# Altium schematic sheet SPC56_ControllerBoard_1.0.0.SchDoc
size 381 x 508 mm
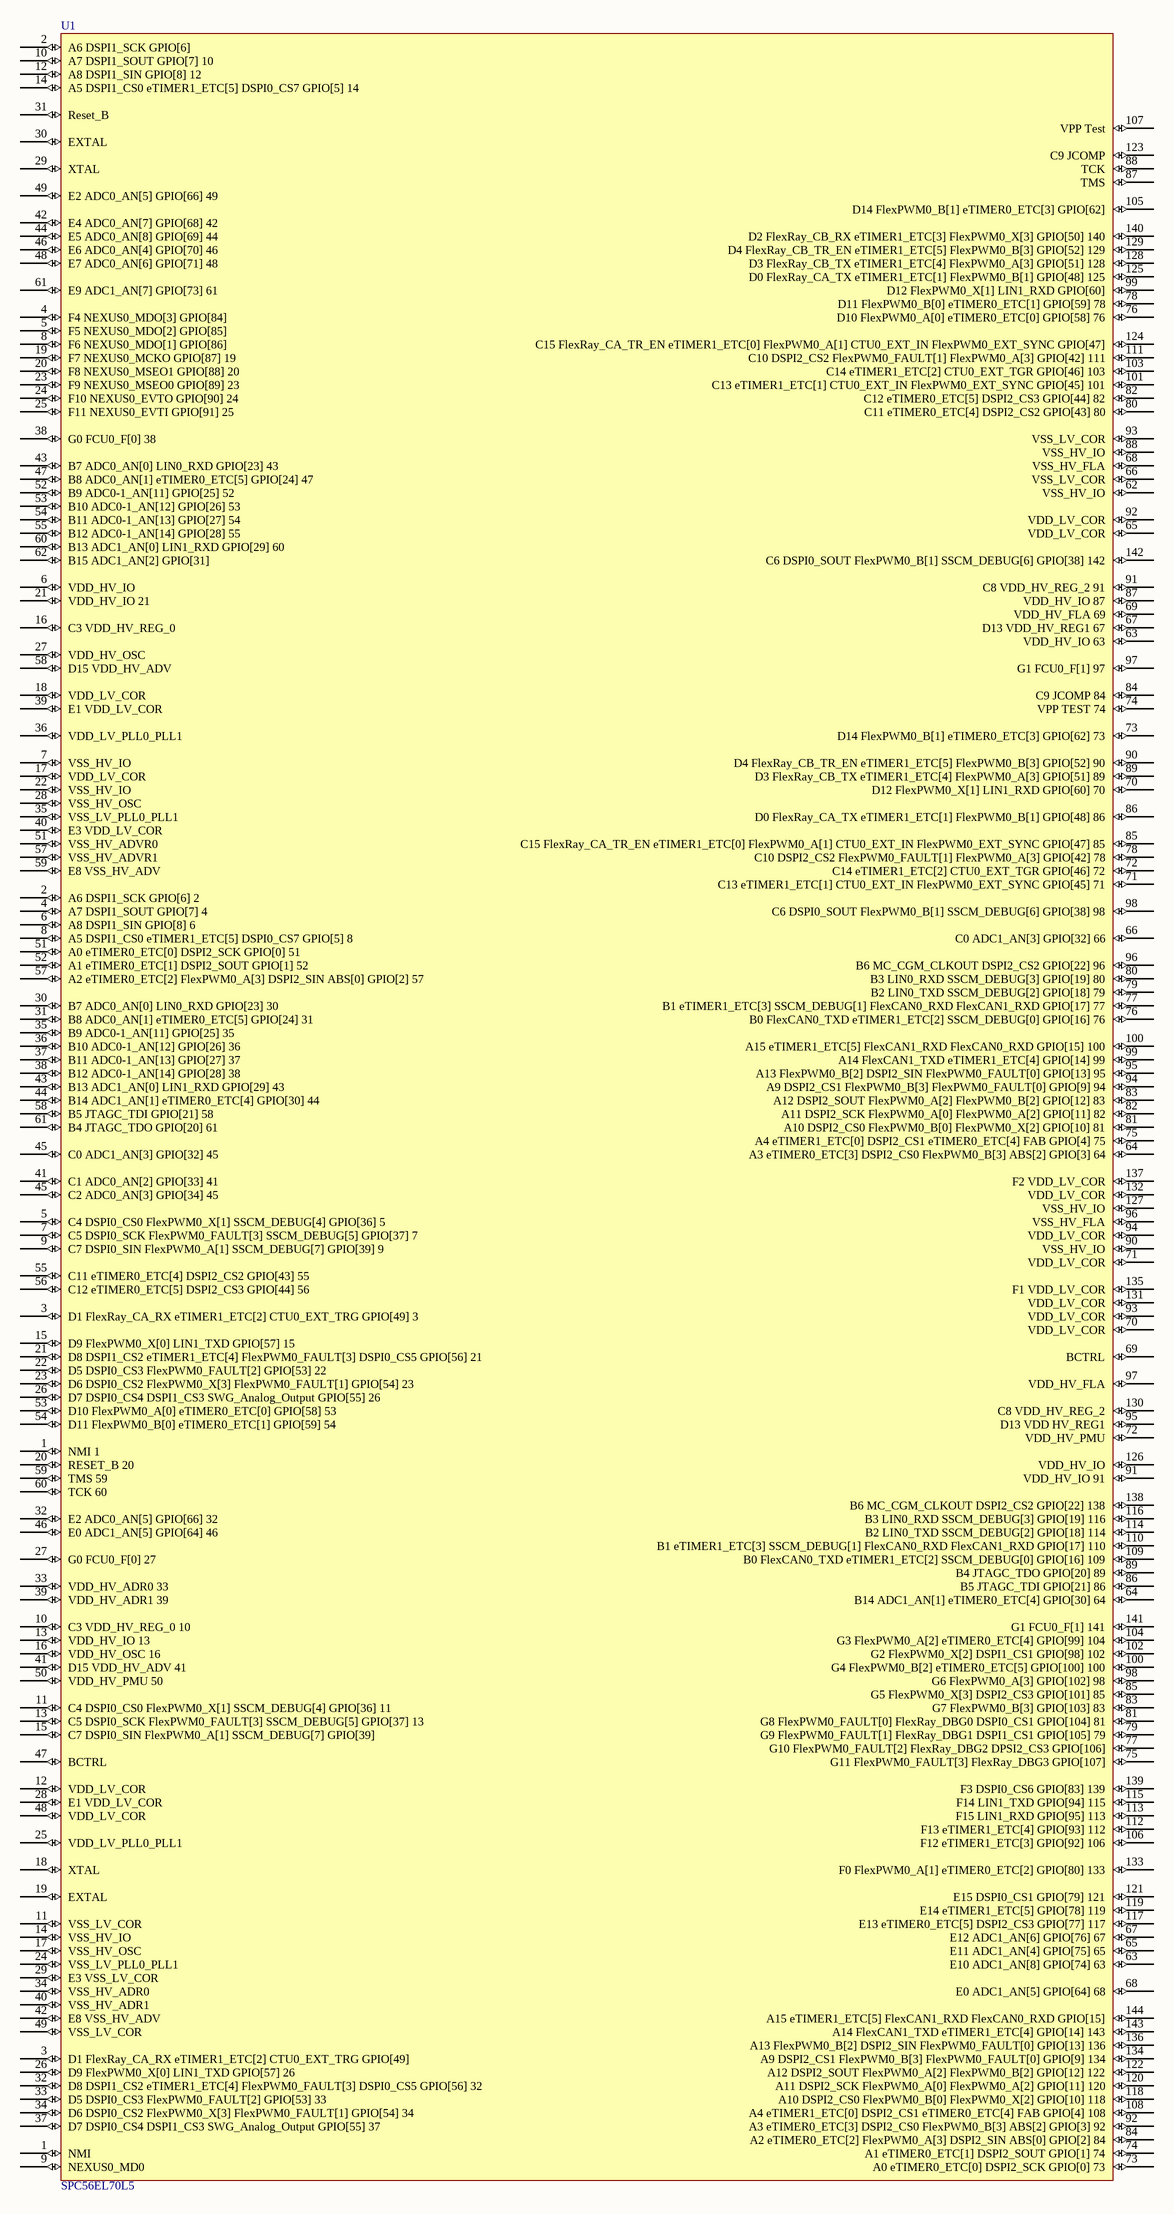
[diagram p0: SPC56_ControllerBoard_1.0.0.SchDoc]

## Parts
U1  SPC56EL70L5  [CQFP50P2200X2200X160-144N]

## Nets

Not connected (* = marked no-connect by the designer): U1 1(NMI) 2(A6_DSPI1_SCK_GPIO[6]) 3(D1_FlexRay_CA_RX_eTIMER1_ETC[2]_CTU0_EXT_TRG_GPIO[49]) 4(F4_NEXUS0_MDO[3]_GPIO[84]) 5(F5_NEXUS0_MDO[2]_GPIO[85]) 6(VDD_HV_IO) 7(VSS_HV_IO) 8(F6_NEXUS0_MDO[1]_GPIO[86]) 9(NEXUS0_MD0) 10(A7_DSPI1_SOUT_GPIO[7]_10) 11(C4_DSPI0_CS0_FlexPWM0_X[1]_SSCM_DEBUG[4]_GPIO[36]_11) 12(A8_DSPI1_SIN_GPIO[8]_12) 13(C5_DSPI0_SCK_FlexPWM0_FAULT[3]_SSCM_DEBUG[5]_GPIO[37]_13) 14(A5_DSPI1_CS0_eTIMER1_ETC[5]_DSPI0_CS7_GPIO[5]_14) 15(C7_DSPI0_SIN_FlexPWM0_A[1]_SSCM_DEBUG[7]_GPIO[39]) 16(C3_VDD_HV_REG_0) 17(VDD_LV_COR) 18(VDD_LV_COR) 19(F7_NEXUS0_MCKO_GPIO[87]_19) 20(F8_NEXUS0_MSEO1_GPIO[88]_20) 21(VDD_HV_IO_21) 22(VSS_HV_IO) 23(F9_NEXUS0_MSEO0_GPIO[89]_23) 24(F10_NEXUS0_EVTO_GPIO[90]_24) 25(F11_NEXUS0_EVTI_GPIO[91]_25) 26(D9_FlexPWM0_X[0]_LIN1_TXD_GPIO[57]_26) 27(VDD_HV_OSC) 28(VSS_HV_OSC) 29(XTAL) 30(EXTAL) 31(Reset_B) 32(D8_DSPI1_CS2_eTIMER1_ETC[4]_FlexPWM0_FAULT[3]_DSPI0_CS5_GPIO[56]_32) 33(D5_DSPI0_CS3_FlexPWM0_FAULT[2]_GPIO[53]_33) 34(D6_DSPI0_CS2_FlexPWM0_X[3]_FlexPWM0_FAULT[1]_GPIO[54]_34) 35(VSS_LV_PLL0_PLL1) 36(VDD_LV_PLL0_PLL1) 37(D7_DSPI0_CS4_DSPI1_CS3_SWG_Analog_Output_GPIO[55]_37) 38(G0_FCU0_F[0]_38) 39(E1_VDD_LV_COR) 40(E3_VDD_LV_COR) 41(C1_ADC0_AN[2]_GPIO[33]_41) 42(E4_ADC0_AN[7]_GPIO[68]_42) 43(B7_ADC0_AN[0]_LIN0_RXD_GPIO[23]_43) 44(E5_ADC0_AN[8]_GPIO[69]_44) 45(C2_ADC0_AN[3]_GPIO[34]_45) 46(E6_ADC0_AN[4]_GPIO[70]_46) 47(B8_ADC0_AN[1]_eTIMER0_ETC[5]_GPIO[24]_47) 48(E7_ADC0_AN[6]_GPIO[71]_48) 49(E2_ADC0_AN[5]_GPIO[66]_49) 50(VDD_HV_PMU_50) 51(VSS_HV_ADVR0) 52(B9_ADC0-1_AN[11]_GPIO[25]_52) 53(B10_ADC0-1_AN[12]_GPIO[26]_53) 54(B11_ADC0-1_AN[13]_GPIO[27]_54) 55(B12_ADC0-1_AN[14]_GPIO[28]_55) 56(C12_eTIMER0_ETC[5]_DSPI2_CS3_GPIO[44]_56) 57(VSS_HV_ADVR1) 58(D15_VDD_HV_ADV) 59(E8_VSS_HV_ADV) 60(B13_ADC1_AN[0]_LIN1_RXD_GPIO[29]_60) 61(E9_ADC1_AN[7]_GPIO[73]_61) 62(B15_ADC1_AN[2]_GPIO[31]) 63(E10_ADC1_AN[8]_GPIO[74]_63) 64(B14_ADC1_AN[1]_eTIMER0_ETC[4]_GPIO[30]_64) 65(E11_ADC1_AN[4]_GPIO[75]_65) 66(C0_ADC1_AN[3]_GPIO[32]_66) 67(E12_ADC1_AN[6]_GPIO[76]_67) 68(E0_ADC1_AN[5]_GPIO[64]_68) 69(BCTRL) 70(VDD_LV_COR) 71(VDD_LV_COR) 72(VDD_HV_PMU) 73(A0_eTIMER0_ETC[0]_DSPI2_SCK_GPIO[0]_73) 74(A1_eTIMER0_ETC[1]_DSPI2_SOUT_GPIO[1]_74) 75(G11_FlexPWM0_FAULT[3]_FlexRay_DBG3_GPIO[107]) 76(D10_FlexPWM0_A[0]_eTIMER0_ETC[0]_GPIO[58]_76) 77(G10_FlexPWM0_FAULT[2]_FlexRay_DBG2_DPSI2_CS3_GPIO[106]) 78(D11_FlexPWM0_B[0]_eTIMER0_ETC[1]_GPIO[59]_78) 79(G9_FlexPWM0_FAULT[1]_FlexRay_DBG1_DSPI1_CS1_GPIO[105]_79) 80(C11_eTIMER0_ETC[4]_DSPI2_CS2_GPIO[43]_80) 81(G8_FlexPWM0_FAULT[0]_FlexRay_DBG0_DSPI0_CS1_GPIO[104]_81) 82(C12_eTIMER0_ETC[5]_DSPI2_CS3_GPIO[44]_82) 83(G7_FlexPWM0_B[3]_GPIO[103]_83) 84(A2_eTIMER0_ETC[2]_FlexPWM0_A[3]_DSPI2_SIN_ABS[0]_GPIO[2]_84) 85(G5_FlexPWM0_X[3]_DSPI2_CS3_GPIO[101]_85) 86(B5_JTAGC_TDI_GPIO[21]_86) 87(TMS) 88(TCK) 89(B4_JTAGC_TDO_GPIO[20]_89) 90(VSS_HV_IO) 91(VDD_HV_IO_91) 92(A3_eTIMER0_ETC[3]_DSPI2_CS0_FlexPWM0_B[3]_ABS[2]_GPIO[3]_92) 93(VDD_LV_COR) 94(VDD_LV_COR) 95(D13_VDD_HV_REG1) 96(VSS_HV_FLA) 97(VDD_HV_FLA) 98(G6_FlexPWM0_A[3]_GPIO[102]_98) 99(D12_FlexPWM0_X[1]_LIN1_RXD_GPIO[60]) 100(G4_FlexPWM0_B[2]_eTIMER0_ETC[5]_GPIO[100]_100) 101(C13_eTIMER1_ETC[1]_CTU0_EXT_IN_FlexPWM0_EXT_SYNC_GPIO[45]_101) 102(G2_FlexPWM0_X[2]_DSPI1_CS1_GPIO[98]_102) 103(C14_eTIMER1_ETC[2]_CTU0_EXT_TGR_GPIO[46]_103) 104(G3_FlexPWM0_A[2]_eTIMER0_ETC[4]_GPIO[99]_104) 105(D14_FlexPWM0_B[1]_eTIMER0_ETC[3]_GPIO[62]) 106(F12_eTIMER1_ETC[3]_GPIO[92]_106) 107(VPP_Test) 108(A4_eTIMER1_ETC[0]_DSPI2_CS1_eTIMER0_ETC[4]_FAB_GPIO[4]_108) 109(B0_FlexCAN0_TXD_eTIMER1_ETC[2]_SSCM_DEBUG[0]_GPIO[16]_109) 110(B1_eTIMER1_ETC[3]_SSCM_DEBUG[1]_FlexCAN0_RXD_FlexCAN1_RXD_GPIO[17]_110) 111(C10_DSPI2_CS2_FlexPWM0_FAULT[1]_FlexPWM0_A[3]_GPIO[42]_111) 112(F13_eTIMER1_ETC[4]_GPIO[93]_112) 113(F15_LIN1_RXD_GPIO[95]_113) 114(B2_LIN0_TXD_SSCM_DEBUG[2]_GPIO[18]_114) 115(F14_LIN1_TXD_GPIO[94]_115) 116(B3_LIN0_RXD_SSCM_DEBUG[3]_GPIO[19]_116) 117(E13_eTIMER0_ETC[5]_DSPI2_CS3_GPIO[77]_117) 118(A10_DSPI2_CS0_FlexPWM0_B[0]_FlexPWM0_X[2]_GPIO[10]_118) 119(E14_eTIMER1_ETC[5]_GPIO[78]_119) 120(A11_DSPI2_SCK_FlexPWM0_A[0]_FlexPWM0_A[2]_GPIO[11]_120) 121(E15_DSPI0_CS1_GPIO[79]_121) 122(A12_DSPI2_SOUT_FlexPWM0_A[2]_FlexPWM0_B[2]_GPIO[12]_122) 123(C9_JCOMP) 124(C15_FlexRay_CA_TR_EN_eTIMER1_ETC[0]_FlexPWM0_A[1]_CTU0_EXT_IN_FlexPWM0_EXT_SYNC_GPIO[47]) 125(D0_FlexRay_CA_TX_eTIMER1_ETC[1]_FlexPWM0_B[1]_GPIO[48]_125) 126(VDD_HV_IO) 127(VSS_HV_IO) 128(D3_FlexRay_CB_TX_eTIMER1_ETC[4]_FlexPWM0_A[3]_GPIO[51]_128) 129(D4_FlexRay_CB_TR_EN_eTIMER1_ETC[5]_FlexPWM0_B[3]_GPIO[52]_129) 130(C8_VDD_HV_REG_2) 131(VDD_LV_COR) 132(VDD_LV_COR) 133(F0_FlexPWM0_A[1]_eTIMER0_ETC[2]_GPIO[80]_133) 134(A9_DSPI2_CS1_FlexPWM0_B[3]_FlexPWM0_FAULT[0]_GPIO[9]_134) 135(F1_VDD_LV_COR) 136(A13_FlexPWM0_B[2]_DSPI2_SIN_FlexPWM0_FAULT[0]_GPIO[13]_136) 137(F2_VDD_LV_COR) 138(B6_MC_CGM_CLKOUT_DSPI2_CS2_GPIO[22]_138) 139(F3_DSPI0_CS6_GPIO[83]_139) 140(D2_FlexRay_CB_RX_eTIMER1_ETC[3]_FlexPWM0_X[3]_GPIO[50]_140) 141(G1_FCU0_F[1]_141) 142(C6_DSPI0_SOUT_FlexPWM0_B[1]_SSCM_DEBUG[6]_GPIO[38]_142) 143(A14_FlexCAN1_TXD_eTIMER1_ETC[4]_GPIO[14]_143) 144(A15_eTIMER1_ETC[5]_FlexCAN1_RXD_FlexCAN0_RXD_GPIO[15])

## Library data of the parts
U1 = SPC56EL70L5 DIP